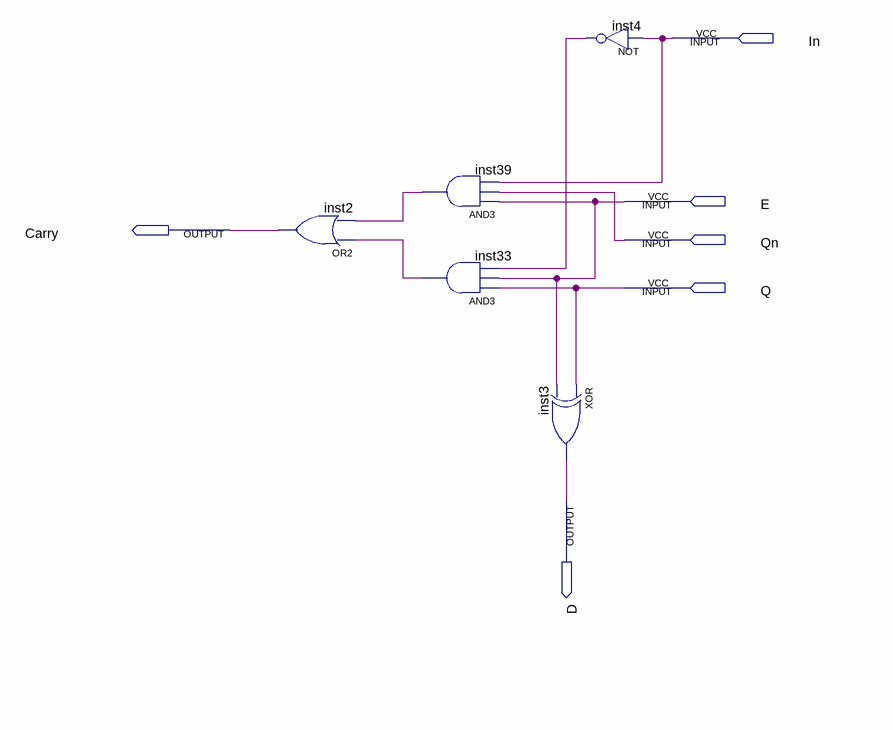
[diagram p0: schematic sheet]
// Quartus schematic HAS.bdf as structural Verilog: 5 symbols, 6 pins
module HAS (
  input  In,
  input  E,
  input  Qn,
  input  Q,
  output Carry,
  output D
);

  wire inst4_out, inst33_out, inst39_out;

  or inst2 (Carry, inst33_out, inst39_out);
  and inst39 (inst39_out, E, Qn, In);
  and inst33 (inst33_out, Q, E, inst4_out);
  xor inst3 (D, Q, E);
  not inst4 (inst4_out, In);
endmodule
